# EAGLE design bms (EAGLE 4.13)
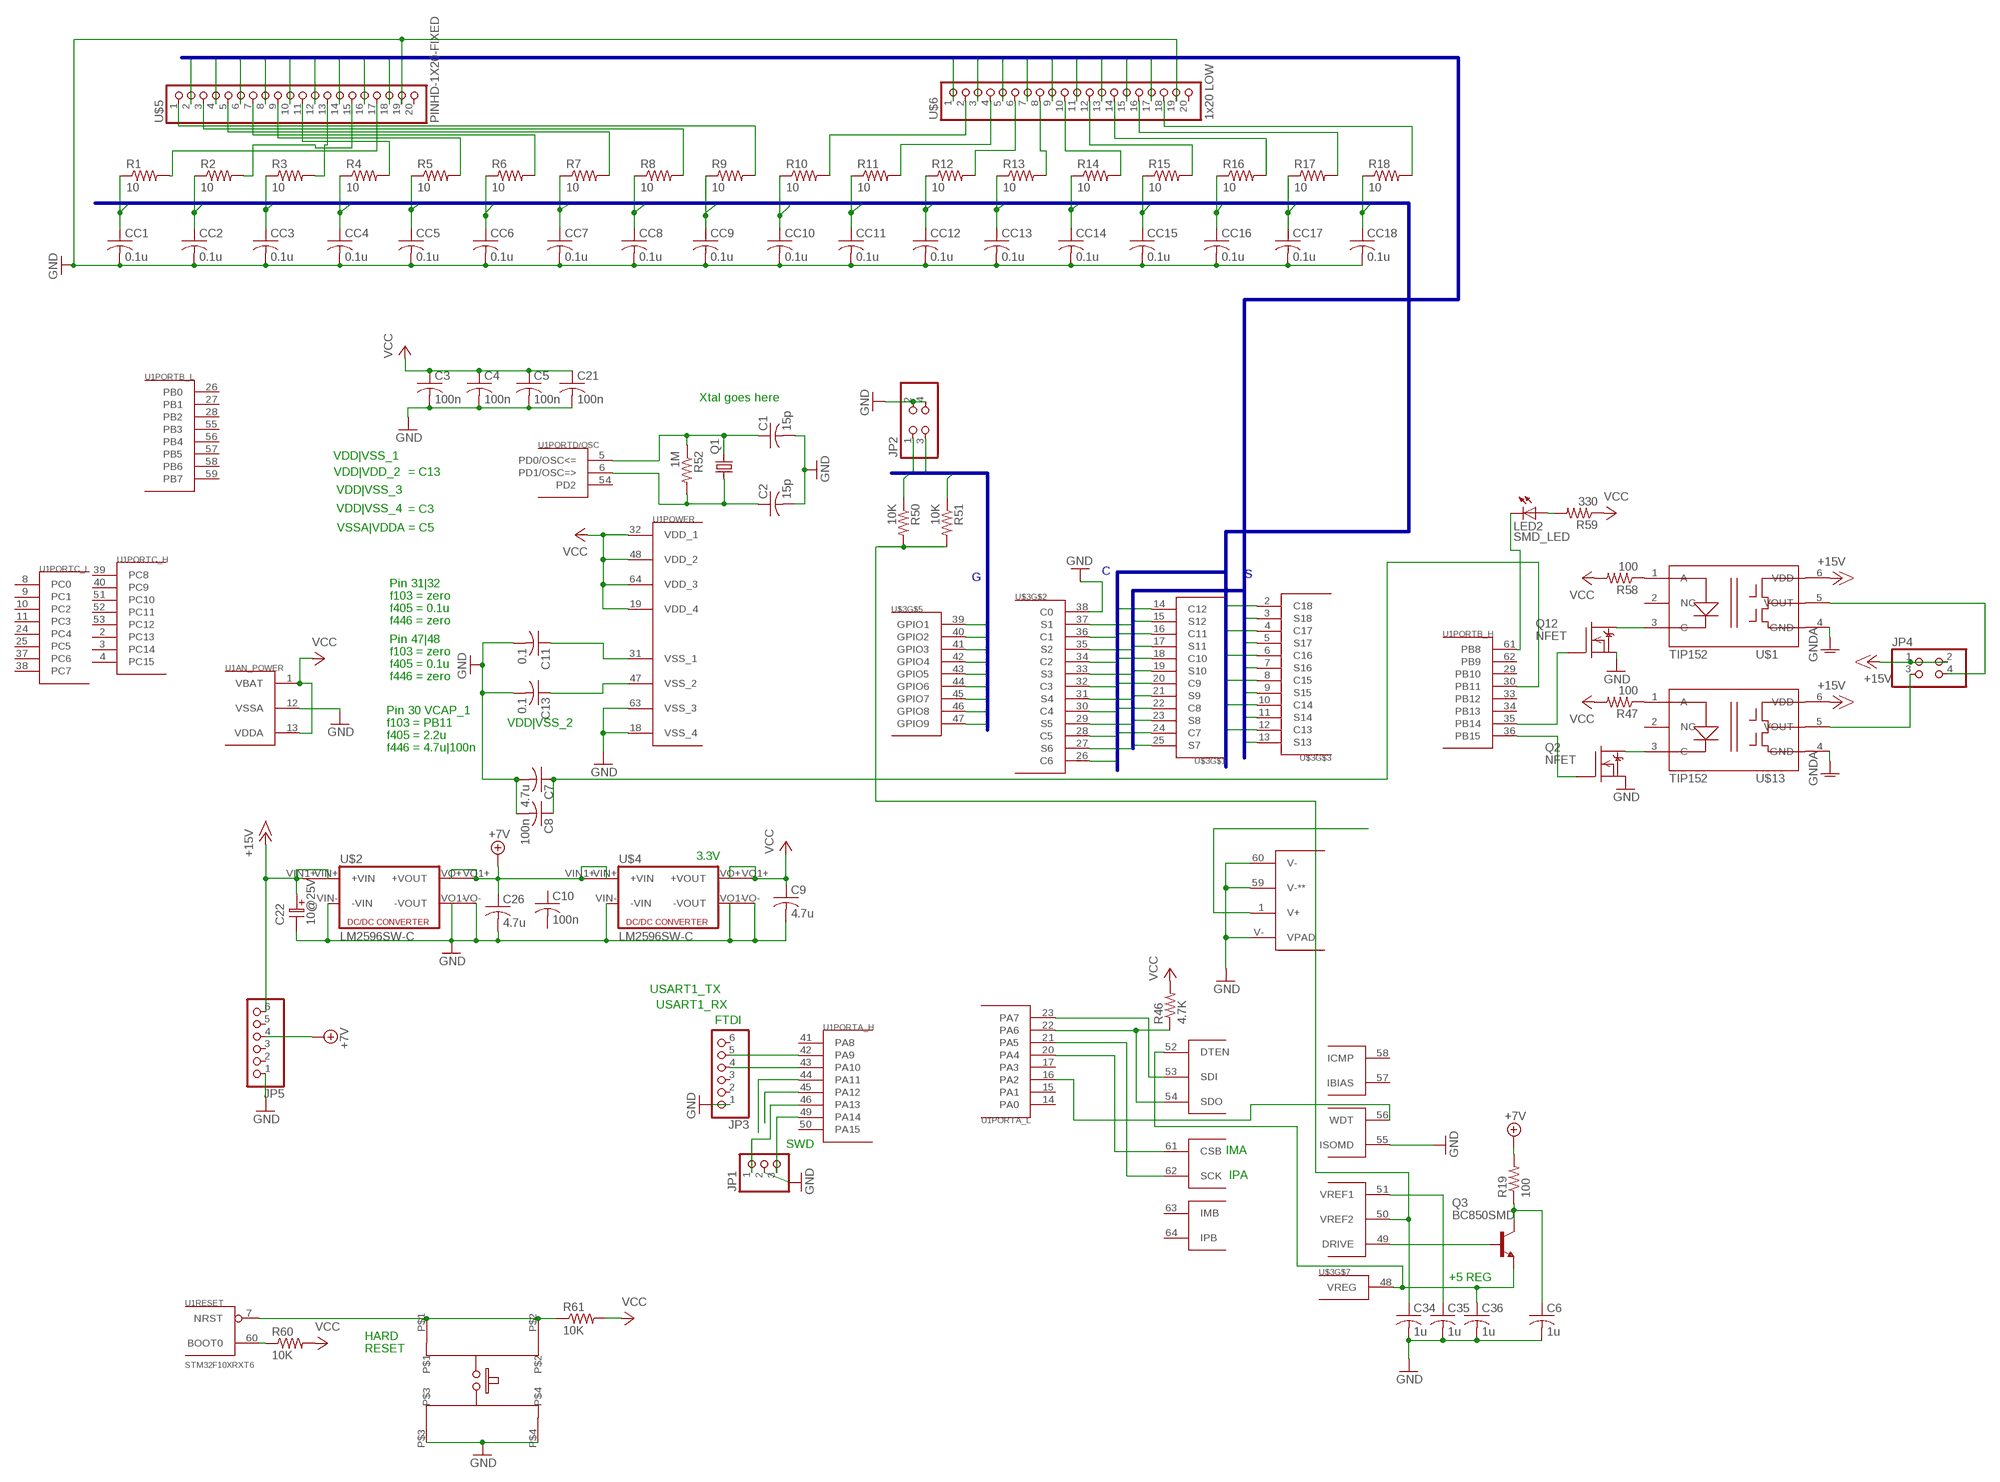
[diagram p0: schematic, sheet 1]

## Parts
C1  15p  C-USC0603  [C0603]
C2  15p  C-USC0603  [C0603]
C3  100n  C-USC0603  [C0603]
C4  100n  C-USC0603  [C0603]
C5  100n  C-USC0603  [C0603]
C6  1u  C-USC0603  [C0603]
C7  4.7u  C-USC0603  [C0603]
C8  100n  C-USC0603  [C0603]
C9  4.7u  C-USC0805  [C0805]
C10  100n  C-USC0603  [C0603]
C11  0.1  C-USC0603  [C0603]
C13  0.1  C-USC0603  [C0603]
C21  100n  C-USC0603  [C0603]
C22  10@25V  ELC-2,5L  [ES-2,5L]
C26  4.7u  C-USC0603  [C0603]
C34  1u  C-USC0603  [C0603]
C35  1u  C-USC0603  [C0603]
C36  1u  C-USC0603  [C0603]
CC1  0.1u  C-USC0805  [C0805]
CC2  0.1u  C-USC0805  [C0805]
CC3  0.1u  C-USC0805  [C0805]
CC4  0.1u  C-USC0805  [C0805]
CC5  0.1u  C-USC0805  [C0805]
CC6  0.1u  C-USC0805  [C0805]
CC7  0.1u  C-USC0805  [C0805]
CC8  0.1u  C-USC0805  [C0805]
CC9  0.1u  C-USC0805  [C0805]
CC10  0.1u  C-USC0805  [C0805]
CC11  0.1u  C-USC0805  [C0805]
CC12  0.1u  C-USC0805  [C0805]
CC13  0.1u  C-USC0805  [C0805]
CC14  0.1u  C-USC0805  [C0805]
CC15  0.1u  C-USC0805  [C0805]
CC16  0.1u  C-USC0805  [C0805]
CC17  0.1u  C-USC0805  [C0805]
CC18  0.1u  C-USC0805  [C0805]
JP1  PINHD-1X3  [1X03]
JP2  PINHD-2X2  [2X02]
JP3  PINHD-1X6  [1X06]
JP4  PINHD-2X2  [2X02]
JP5  PINHD-1X6  [1X06]
LED2  SMD_LED  [SMD_LED]
Q1  CRYTALHC49S  [HC49/S]
Q2  NFET  DMN3404L  [SOT-23]
Q3  BC850SMD  [SOT23-BEC]
Q12  NFET  DMN3404L  [SOT-23]
R1  10  R-US_R0603  [R0603]
R2  10  R-US_R0603  [R0603]
R3  10  R-US_R0603  [R0603]
R4  10  R-US_R0603  [R0603]
R5  10  R-US_R0603  [R0603]
R6  10  R-US_R0603  [R0603]
R7  10  R-US_R0603  [R0603]
R8  10  R-US_R0603  [R0603]
R9  10  R-US_R0603  [R0603]
R10  10  R-US_R0603  [R0603]
R11  10  R-US_R0603  [R0603]
R12  10  R-US_R0603  [R0603]
R13  10  R-US_R0603  [R0603]
R14  10  R-US_R0603  [R0603]
R15  10  R-US_R0603  [R0603]
R16  10  R-US_R0603  [R0603]
R17  10  R-US_R0603  [R0603]
R18  10  R-US_R0603  [R0603]
R19  100  R-US_R0603  [R0603]
R46  4.7K  R-US_R0603  [R0603]
R47  100  R-US_R0603  [R0603]
R50  10K  R-US_R0603  [R0603]
R51  10K  R-US_R0603  [R0603]
R52  1M  R-US_R0603  [R0603]
R58  100  R-US_R0603  [R0603]
R59  330  R-US_R0603  [R0603]
R60  10K  R-US_R0603  [R0603]
R61  10K  R-US_R0603  [R0603]
SW1  E-SWITCH  [E-SWITCH]
U1  STM32F10XRXT6  [TQFP64]
U$1  TIP152  SI826  [SDIP6]
U$2  LM2596SW-C  [LM2596SW-C]
U$3  LTC6813  [TQFP64_PAD]
U$4  LM2596SW-C  [LM2596SW-C]
U$5  PINHD-1X20-FIXED  [1X20]
U$6  1x20 LOW  PINHD-1X20-FIXED  [1X20]
U$13  TIP152  SI826  [SDIP6]

## Nets
+7V: C26.1 JP5.4 R19.2 U$2.VO1+(+VOUT1) U$2.VO+(+VOUT) U$4.VIN+(+VIN)
+15V: C22.1 JP4.1 JP4.2 JP5.6 U$1.6(VDD) U$2.VIN1+(+VIN1) U$2.VIN+(+VIN) U$13.6(VDD)
BOOT0: R60.1 U1.60(RESET:BOOT0)
C1: CC1.1 R1.1 U$3.36(C1)
C2: CC2.1 R2.1 U$3.34(C2)
C3: CC3.1 R3.1 U$3.32(C3)
C4: CC4.1 R4.1 U$3.30(C4)
C5: CC5.1 R5.1 U$3.28(C5)
C6: CC6.1 R6.1 U$3.26(C6)
C7: CC7.1 R7.1 U$3.24(C7)
C8: CC8.1 R8.1 U$3.22(C8)
C9: CC9.1 R9.1 U$3.20(C9)
C10: CC10.1 R10.1 U$3.18(C10)
C11: CC11.1 R11.1 U$3.16(C11)
C12: CC12.1 R12.1 U$3.14(C12)
C13: CC13.1 R13.1 U$3.12(C13)
C14: CC14.1 R14.1 U$3.10(C14)
C15: CC15.1 R15.1 U$3.8(C15)
C16: CC16.1 R16.1 U$3.6(C16)
C17: CC17.1 R17.1 U$3.4(C17)
C18: CC18.1 R18.1 U$3.2(C18)
CF10: R10.2 U$6.2
CF11: R11.2 U$6.4
CF12: R12.2 U$6.6
CF13: R13.2 U$6.8
CF14: R14.2 U$6.10
CF15: R15.2 U$6.12
CF16: R16.2 U$6.14
CF17: R17.2 U$6.16
CF18: R18.2 U$6.18
CL1: R1.2 U$5.17
CL2: R2.2 U$5.15
CL3: R3.2 U$5.13
CL4: R4.2 U$5.11
CL5: R5.2 U$5.9
CL6: R6.2 U$5.7
CL7: R7.2 U$5.5
CL8: R8.2 U$5.3
CL9: R9.2 U$5.1
G1: JP2.1 R50.1 U$3.39(GPIO1)
G2: JP2.3 R51.1 U$3.40(GPIO2)
G3: U$3.41(GPIO3)
G4: U$3.42(GPIO4)
G5: U$3.43(GPIO5)
G6: U$3.44(GPIO6)
G7: U$3.45(GPIO7)
G8: U$3.46(GPIO8)
G9: U$3.47(GPIO9)
GND: C1.2 C2.2 C3.2 C4.2 C5.2 C6.2 C7.2 C8.2 C9.2 C11.2 C13.2 C21.2 C22.2 C26.2 C34.2 C35.2 C36.2 CC1.2 CC2.2 CC3.2 CC4.2 CC5.2 CC6.2 CC7.2 CC8.2 CC9.2 CC10.2 CC11.2 CC12.2 CC13.2 CC14.2 CC15.2 CC16.2 CC17.2 CC18.2 JP1.2 JP2.2 JP2.4 JP3.1 JP5.1 Q2.2(S) Q12.2(S) SW1.P$3 SW1.P$4 U1.12(AN_POWER:VSSA) U1.18(POWER:VSS_4) U1.63(POWER:VSS_3) U$2.VIN-(-VIN) U$2.VO1-(-VOUT) U$2.VO-(-VOUT1) U$3.38(C0) U$3.55(ISOMD) U$3.59(V-**) U$3.60(V-) U$3.V-(VPAD) U$4.VIN-(-VIN) U$4.VO1-(-VOUT) U$4.VO-(-VOUT1) U$5.19 U$6.19
GNDA: U$1.4(GND) U$13.4(GND)
JTCK: JP1.3 U1.49(PORTA_H:PA14)
JTMS: JP1.1 U1.46(PORTA_H:PA13)
LED|R: LED2.A R59.2
N$1: Q3.B U$3.49(DRIVE)
N$2: C6.1 Q3.C R19.1
N$3: JP4.3 U$13.5(VOUT)
N$8: JP4.4 U$1.5(VOUT)
N$10: R58.1 U$1.1(A)
N$11: R47.1 U$13.1(A)
N$12: Q12.3(D) U$1.3(C)
N$13: Q2.3(D) U$13.3(C)
N$14: Q2.1(G) U1.36(PORTB_H:PB15)
N$15: Q12.1(G) U1.35(PORTB_H:PB14)
NRST: R61.1 SW1.P$1 SW1.P$2 U1.7(RESET:NRST)
PA2|WDT: U1.16(PORTA_L:PA2) U$3.56(WDT)
PA9_USART1_TX: JP3.5 U1.42(PORTA_H:PA9)
PA10_USART1_RX: JP3.4 U1.43(PORTA_H:PA10)
PA11_CANRXD: U1.44(PORTA_H:PA11)
PA12-CANTXD: U1.45(PORTA_H:PA12)
PB8|LED: LED2.C U1.61(PORTB_H:PB8)
PB11|VCAP: C7.1 C8.1 U1.30(PORTB_H:PB11)
PD0_OSC_IN_XTAL: C1.1 Q1.2 R52.1 U1.5(PORTD/OSC:PD0/OSC<=)
PD1_OSC_OUT: C2.1 Q1.1 R52.2 U1.6(PORTD/OSC:PD1/OSC=>)
S1: U$3.37(S1) U$5.18
S2: U$3.35(S2) U$5.16
S3: U$3.33(S3) U$5.14
S4: U$3.31(S4) U$5.12
S5: U$3.29(S5) U$5.10
S6: U$3.27(S6) U$5.8
S7: U$3.25(S7) U$5.6
S8: U$3.23(S8) U$5.4
S9: U$3.21(S9) U$5.2
S10: U$3.19(S10) U$6.1
S11: U$3.17(S11) U$6.3
S12: U$3.15(S12) U$6.5
S13: U$3.13(S13) U$6.7
S14: U$3.11(S14) U$6.9
S15: U$3.9(S15) U$6.11
S16: U$3.7(S16) U$6.13
S17: U$3.5(S17) U$6.15
S18: U$3.3(S18) U$6.17
SP1_MISO-SDO: R46.1 U1.22(PORTA_L:PA6) U$3.54(SDO)
SP1_NSS-CSB: U1.20(PORTA_L:PA4) U$3.61(CSB)
SPI1_MOSI-SDI: U1.23(PORTA_L:PA7) U$3.53(SDI)
SPI1_SCK-CLK: U1.21(PORTA_L:PA5) U$3.62(SCK)
VCC: C3.1 C4.1 C5.1 C9.1 C21.1 R46.2 R47.2 R58.2 R59.1 R60.2 R61.2 U1.1(AN_POWER:VBAT) U1.13(AN_POWER:VDDA) U1.19(POWER:VDD_4) U1.32(POWER:VDD_1) U1.48(POWER:VDD_2) U1.64(POWER:VDD_3) U$4.VO1+(+VOUT1) U$4.VO+(+VOUT)
VREF1: C35.1 U$3.51(VREF1)
VREF2: C34.1 R50.2 R51.2 U$3.50(VREF2)
VREG: C36.1 Q3.E U$3.48(VREG) U$3.52(DTEN)
VSS_1: C11.1 U1.31(POWER:VSS_1)
VSS_2: C13.1 U1.47(POWER:VSS_2)
X18: U$3.1(V+)
Unconnected: C10.1 C10.2 JP3.2 JP3.3 JP3.6 JP5.2 JP5.3 JP5.5 U1.2(PORTC_H:PC13) U1.3(PORTC_H:PC14) U1.4(PORTC_H:PC15) U1.8(PORTC_L:PC0) U1.9(PORTC_L:PC1) U1.10(PORTC_L:PC2) U1.11(PORTC_L:PC3) U1.14(PORTA_L:PA0) U1.15(PORTA_L:PA1) U1.17(PORTA_L:PA3) U1.24(PORTC_L:PC4) U1.25(PORTC_L:PC5) U1.26(PORTB_L:PB0) U1.27(PORTB_L:PB1) U1.28(PORTB_L:PB2) U1.29(PORTB_H:PB10) U1.33(PORTB_H:PB12) U1.34(PORTB_H:PB13) U1.37(PORTC_L:PC6) U1.38(PORTC_L:PC7) U1.39(PORTC_H:PC8) U1.40(PORTC_H:PC9) U1.41(PORTA_H:PA8) U1.50(PORTA_H:PA15) U1.51(PORTC_H:PC10) U1.52(PORTC_H:PC11) U1.53(PORTC_H:PC12) U1.54(PORTD/OSC:PD2) U1.55(PORTB_L:PB3) U1.56(PORTB_L:PB4) U1.57(PORTB_L:PB5) U1.58(PORTB_L:PB6) U1.59(PORTB_L:PB7) U1.62(PORTB_H:PB9) U$1.2(NC) U$3.57(IBIAS) U$3.58(ICMP) U$3.63(IMB) U$3.64(IPB) U$4.VIN1+(+VIN1) U$5.20 U$6.20 U$13.2(NC)

## Buses
G[1..9]
C[0..18]
S[1..18]

## Notes on the sheet
- Xtal goes here
- VDD|VSS_1
- VDD|VDD_2 | = C13
- VDD|VSS_3
- VDD|VSS_4
- = C3
- VSSA|VDDA = C5
- C | S
- G
- Pin 31|32
- f103 = zero
- f405 = 0.1u
- f446 = zero
- Pin 47|48
- f103 = zero
- f405 = 0.1u
- f446 = zero
- Pin 30 VCAP_1
- f103 = PB11 | VDD|VSS_2
- f405 = 2.2u
- f446 = 4.7u|100n
- 3.3V
- USART1_TX
- USART1_RX
- FTDI
- SWD
- IMA
- IPA
- +5 REG
- HARD
- RESET

## Library data of the parts
C1-C11 C13 C21 C26 C34-C36 CC1-CC18 = rcl:C-US: CAPACITOR, American symbol
C22 = DEH:ELC-2,5L
JP1 = pinhead:PINHD-1X3: PIN HEADER
JP2 JP4 = pinhead:PINHD-2X2: PIN HEADER
JP3 JP5 = pinhead:PINHD-1X6: PIN HEADER
LED2 = led:SMD_LED
Q1 = crystal:CRYTAL: CRYSTAL
Q2 Q12 = transistor-fet:DMN3404L
Q3 = transistor-npn:BC850*: NPN Transistor
R1-R19 R46 R47 R50-R52 R58-R61 = rcl:R-US_: RESISTOR, American symbol
SW1 = switch-misc:E-SWITCH
U1 = stm32:STM32F10XRXT6: STM32F101/103 64pin LQFP
U$1 U$13 = DEH:SI826
U$2 U$4 = dc-dc-converter:LM2596SW-C
U$3 = stm32:LTC6813
U$5 U$6 = pinhead:PINHD-1X20-FIXED

## Board
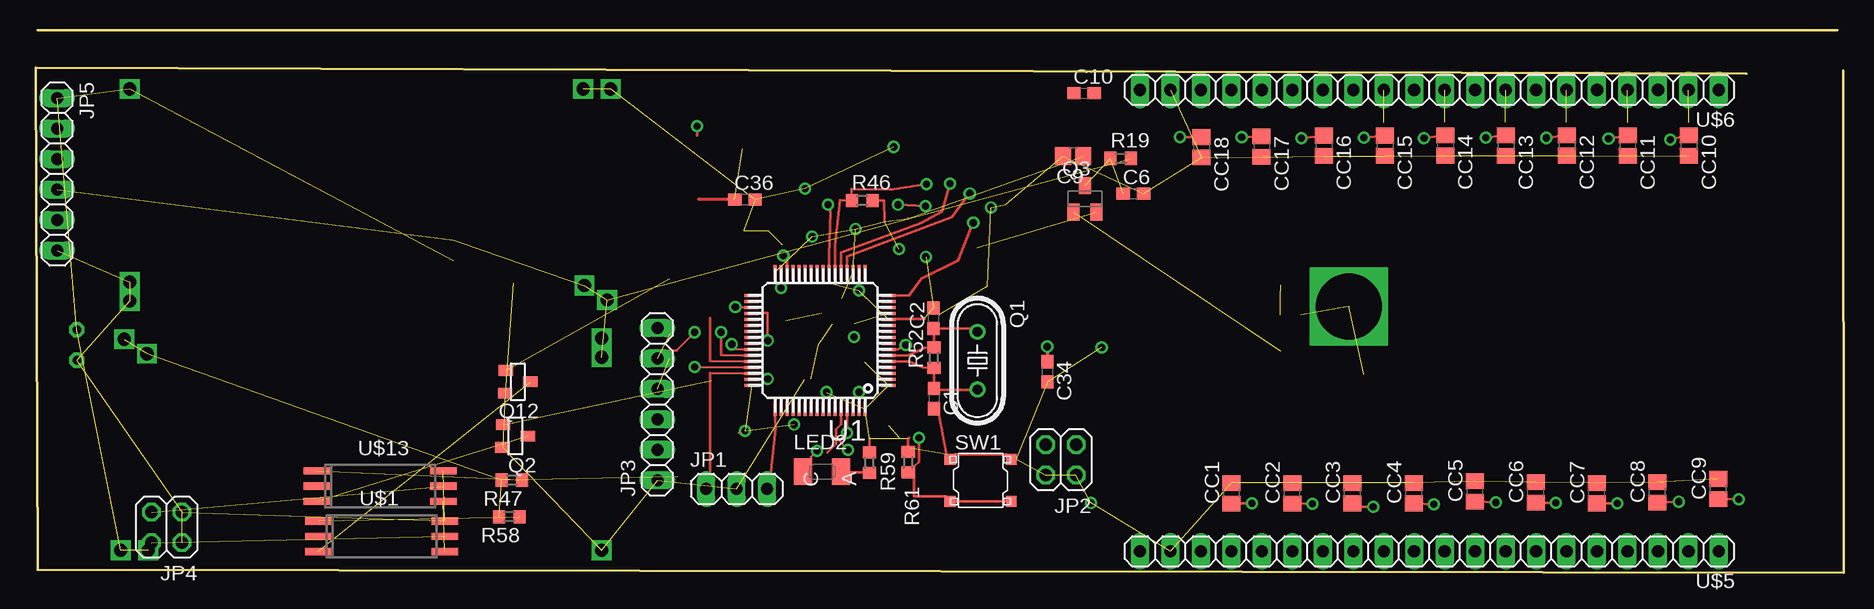
[diagram p1: board, top side]
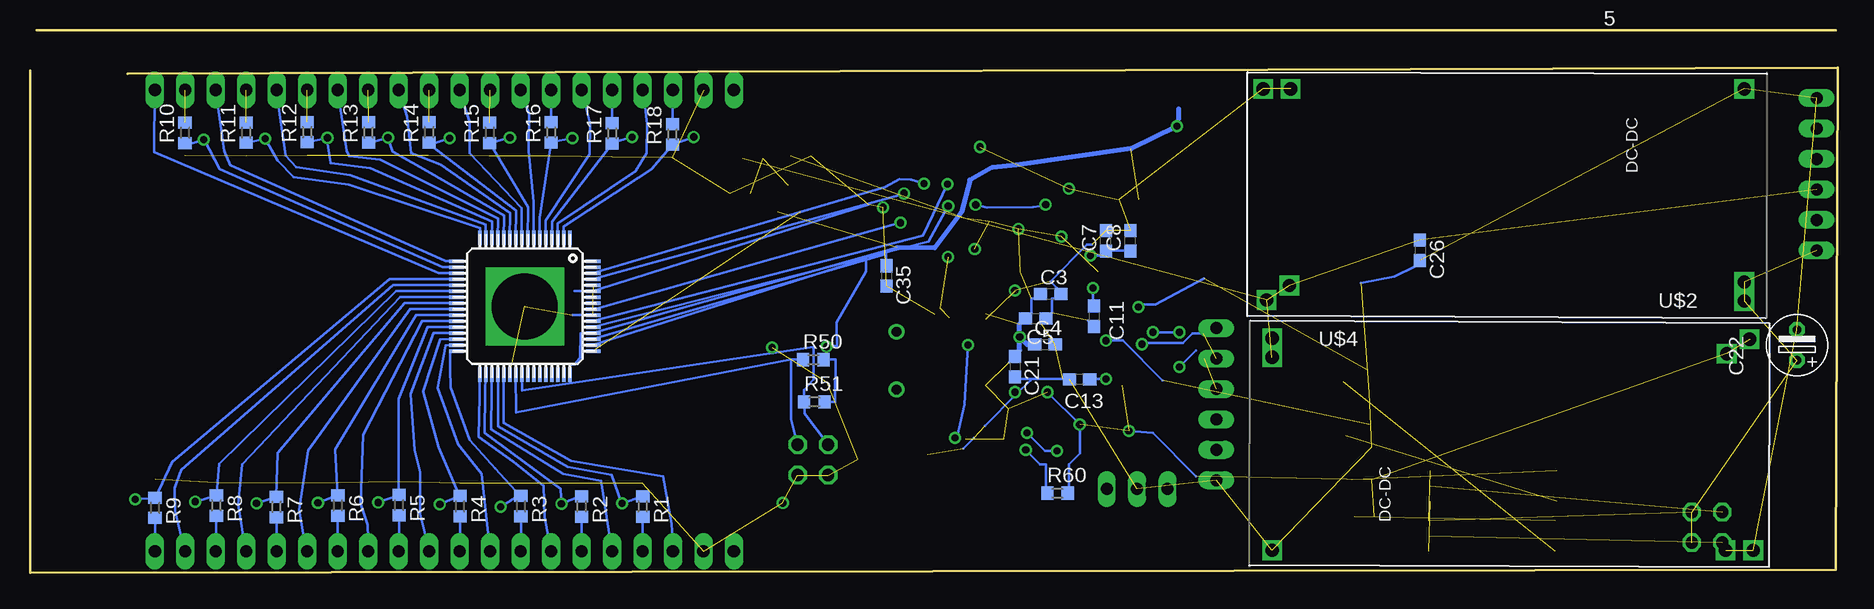
[diagram p2: board, bottom side, seen from below]

Size 150.7 x 45.25 mm. Coordinates in mm from the lower left corner, seen from the top.
Outline: 0,42.11 0.16,0.24 150.7,0 150.67,41.84
Outline: 0,42.11 0,41.94
Outline: 0,42.11 142.56,41.61
Outline: 0.16,45.25 150.14,45.24
Copper layers (1*16): Top 0.035mm / dielectric 1.5mm / Bottom 0.035mm
Design rules "default": minimum track width 8mil, minimum drill 0.6mm, track to track 0.2083mm, track to pad 8mil, pad to pad 8mil, via to via 8mil, smd to smd 0mil, copper to edge 8mil, drill to drill 8mil, minimum pad ring 10mil, minimum via ring 8mil, stop-mask expansion 4mil, vias tented up to drill 0mil, thermal gap 10mil

### Footprints (pad centres in the part's own frame; a part is rotated, then mirrored left to right if it is on the bottom)
C0603 = smd 1.1 x 1: 1 -0.85,0; 2 0.85,0
C0805 = smd 1.3 x 1.5: 1 -0.85,0; 2 0.85,0
ES-2,5L = drill 0.711 pad 1.27 octagon: 1 0,0; 2 2.54,0
1X03 = drill 1 long: 1 -2.54,0; 2 0,0; 3 2.54,0
2X02 = drill 1.016 octagon: 1 -1.27,-1.27; 2 -1.27,1.27; 3 1.27,-1.27; 4 1.27,1.27
1X06 = drill 1 long: 1 -6.35,0; 2 -3.81,0; 3 -1.27,0; 4 1.27,0; 5 3.81,0; 6 6.35,0
SMD_LED = smd 2.2 x 1.5: A 0,1.6; C 0,-1.6
HC49/S = drill 0.813 round: 1 -2.413,0; 2 2.413,0
SOT-23 = smd 0.9 x 1.2: 1 -1,-1.006; 2 0.9,-1.056; 3 -0.05,1.056
SOT23-BEC = smd 1 x 1.4: B -0.95,-1.1; C 0,1.1; E 0.95,-1.1
R0603 = smd 1 x 1.1: 1 -0.85,0; 2 0.85,0
E-SWITCH = smd 0.9 x 0.9: P$1 -2.55,1.75; P$2 2.55,1.75; P$3 -2.55,-1.75; P$4 2.55,-1.75
TQFP64 = smd 1.2 x 0.26: 1 -5.7,3.75; 2 -5.7,3.25; 3 -5.7,2.75; 4 -5.7,2.25; 5 -5.7,1.75; 6 -5.7,1.25; 7 -5.7,0.75; 8 -5.7,0.25; 9 -5.7,-0.25; 10 -5.7,-0.75; 11 -5.7,-1.25; 12 -5.7,-1.75; 13 -5.7,-2.25; 14 -5.7,-2.75; 15 -5.7,-3.25; 16 -5.7,-3.75; 33 5.7,-3.75; 34 5.7,-3.25; 35 5.7,-2.75; 36 5.7,-2.25; 37 5.7,-1.75; 38 5.7,-1.25; 39 5.7,-0.75; 40 5.7,-0.25; 41 5.7,0.25; 42 5.7,0.75; 43 5.7,1.25; 44 5.7,1.75; 45 5.7,2.25; 46 5.7,2.75; 47 5.7,3.25; 48 5.7,3.75 | smd 0.26 x 1.2: 17 -3.75,-5.7; 18 -3.25,-5.7; 19 -2.75,-5.7; 20 -2.25,-5.7; 21 -1.75,-5.7; 22 -1.25,-5.7; 23 -0.75,-5.7; 24 -0.25,-5.7; 25 0.25,-5.7; 26 0.75,-5.7; 27 1.25,-5.7; 28 1.75,-5.7; 29 2.25,-5.7; 30 2.75,-5.7; 31 3.25,-5.7; 32 3.75,-5.7; 49 3.75,5.7; 50 3.25,5.7; 51 2.75,5.7; 52 2.25,5.7; 53 1.75,5.7; 54 1.25,5.7; 55 0.75,5.7; 56 0.25,5.7; 57 -0.25,5.7; 58 -0.75,5.7; 59 -1.25,5.7; 60 -1.75,5.7; 61 -2.25,5.7; 62 -2.75,5.7; 63 -3.25,5.7; 64 -3.75,5.7
SDIP6 = smd 0.6 x 2.2: 1 -1.895,-5.33; 2 -0.625,-5.33; 3 0.645,-5.33; 4 0.645,5.22; 5 -0.625,5.22; 6 -1.895,5.22
LM2596SW-C = drill 1.1 square: VIN1+ -19,9.5; VIN+ -19,7.9; VIN- -19,-8.2; VO1+ 20.8,9.4; VO1- 21.1,-8.2; VO+ 18.9,8.2; VO- 18.8,-8.2
TQFP64_PAD = smd 1.2 x 0.26: 1 -5.7,3.75; 2 -5.7,3.25; 3 -5.7,2.75; 4 -5.7,2.25; 5 -5.7,1.75; 6 -5.7,1.25; 7 -5.7,0.75; 8 -5.7,0.25; 9 -5.7,-0.25; 10 -5.7,-0.75; 11 -5.7,-1.25; 12 -5.7,-1.75; 13 -5.7,-2.25; 14 -5.7,-2.75; 15 -5.7,-3.25; 16 -5.7,-3.75; 33 5.7,-3.75; 34 5.7,-3.25; 35 5.7,-2.75; 36 5.7,-2.25; 37 5.7,-1.75; 38 5.7,-1.25; 39 5.7,-0.75; 40 5.7,-0.25; 41 5.7,0.25; 42 5.7,0.75; 43 5.7,1.25; 44 5.7,1.75; 45 5.7,2.25; 46 5.7,2.75; 47 5.7,3.25; 48 5.7,3.75 | smd 0.26 x 1.2: 17 -3.75,-5.7; 18 -3.25,-5.7; 19 -2.75,-5.7; 20 -2.25,-5.7; 21 -1.75,-5.7; 22 -1.25,-5.7; 23 -0.75,-5.7; 24 -0.25,-5.7; 25 0.25,-5.7; 26 0.75,-5.7; 27 1.25,-5.7; 28 1.75,-5.7; 29 2.25,-5.7; 30 2.75,-5.7; 31 3.25,-5.7; 32 3.75,-5.7; 49 3.75,5.7; 50 3.25,5.7; 51 2.75,5.7; 52 2.25,5.7; 53 1.75,5.7; 54 1.25,5.7; 55 0.75,5.7; 56 0.25,5.7; 57 -0.25,5.7; 58 -0.75,5.7; 59 -1.25,5.7; 60 -1.75,5.7; 61 -2.25,5.7; 62 -2.75,5.7; 63 -3.25,5.7; 64 -3.75,5.7 | smd 5.8 x 5.8: V- 0,0
1X20 = drill 1.016 long: 1 -24.13,0; 2 -21.59,0; 3 -19.05,0; 4 -16.51,0; 5 -13.97,0; 6 -11.43,0; 7 -8.89,0; 8 -6.35,0; 9 -3.81,0; 10 -1.27,0; 11 1.27,0; 12 3.81,0; 13 6.35,0; 14 8.89,0; 15 11.43,0; 16 13.97,0; 17 16.51,0; 18 19.05,0; 19 21.59,0; 20 24.13,0

### Placement (x,y rotation side)
C1  74.86,14.51 270 top
C2  74.84,21.2 90 top
C3  65.61,23.25 0 bottom
C4  66.09,19.01 0 bottom
C5  66.86,21.18 0 bottom
C6  91.49,31.6 0 top
C7  61.03,27.66 90 bottom
C8  58.99,27.67 90 bottom
C9  86.46,34.72 180 top
C10  87.37,39.98 0 top
C11  62.01,21.37 270 bottom
C13  63.21,16.1 180 bottom
C21  68.61,17.16 270 bottom
C22  3.41,17.7 90 bottom
C26  34.83,26.88 270 bottom
C34  84.3,16.74 270 top
C35  79.31,24.74 270 bottom
C36  59.1,31.12 0 top
CC1  99.67,6.61 90 top
CC2  104.72,6.61 90 top
CC3  109.75,6.62 90 top
CC4  114.86,6.62 90 top
CC5  119.96,6.77 90 top
CC6  125.02,6.68 90 top
CC7  130.12,6.62 90 top
CC8  135.15,6.69 90 top
CC9  140.25,6.96 90 top
CC10  137.79,35.61 270 top
CC11  132.68,35.6 270 top
CC12  127.61,35.62 270 top
CC13  122.53,35.61 270 top
CC14  117.48,35.62 270 top
CC15  112.44,35.59 270 top
CC16  107.35,35.59 270 top
CC17  102.17,35.51 270 top
CC18  97.16,35.46 270 top
JP1  58.41,6.97 0 top
JP2  85.44,9.39 180 top
JP3  51.81,14.04 90 top
JP4  10.91,3.77 180 top
JP5  1.77,33.22 270 top
LED2  65.53,8.42 270 top
Q1  78.48,17.67 270 top
Q2  39.95,11.33 270 top
Q3  87.45,31.17 0 top
Q12  40.17,15.86 270 top
R1  99.62,5.51 270 bottom
R2  104.72,5.51 270 bottom
R3  109.78,5.53 270 bottom
R4  114.85,5.53 270 bottom
R5  119.94,5.63 270 bottom
R6  125.04,5.6 270 bottom
R7  130.15,5.47 270 bottom
R8  135.16,5.6 270 bottom
R9  140.28,5.4 270 bottom
R10  137.78,36.68 90 bottom
R11  132.68,36.69 90 bottom
R12  127.59,36.73 90 bottom
R13  122.48,36.7 90 bottom
R14  117.43,36.72 90 bottom
R15  112.38,36.68 90 bottom
R16  107.25,36.71 90 bottom
R17  102.17,36.62 90 bottom
R18  97.15,36.54 90 bottom
R19  90.44,34.54 0 top
R46  68.87,31.03 0 top
R47  39.68,7.71 180 top
R50  85.4,17.75 0 bottom
R51  85.31,14.24 0 bottom
R52  74.86,17.9 90 top
R58  39.47,4.65 180 top
R59  69.48,9.16 270 top
R60  65.05,6.62 0 bottom
R61  72.71,9.19 90 top
SW1  78.75,7.7 180 top
U1  65.37,19.36 180 top
U$1  28.87,2.4 270 top
U$2  26.81,32.14 180 bottom
U$3  109.45,22.21 270 bottom
U$4  28.16,10.05 0 bottom
U$5  116.16,1.77 180 top
U$6  116.16,40.25 180 top
U$13  28.74,6.58 270 top

### Tracks (layer width: path | path; a pad name or v marks a point on that pad's centre or on a via)
+7V  (5 unrouted)
+15V  (7 unrouted)
BOOT0  (via drill 0.6)
  Top 0.203: 66,10.04 66.7,10.74 66.7,11.14 | 66.7,11.14 66.7,11.94 67.1,12.34 67.1,13.14 U1.60 | v67.7,10.24 66.8,11.14 66.7,11.14
  Bottom 0.203: v67.7,10.24 66.5,9.04 66,9.04 66,7.14 R60.1
C1  (via drill 0.6)
  Top 0.203: v101.35,5.76 CC1.1
  Bottom 0.203: U$3.36 111.69,15.25 111.67,12.18 105.87,8.8 102.21,8.14 101.39,5.78 v101.35,5.76 R1.1
C2  (via drill 0.6)
  Top 0.203: v106.4,5.74 CC2.1
  Bottom 0.203: U$3.34 112.75,14.93 112.81,11.64 106.47,6.97 106.4,5.6 v106.4,5.74 104.74,6.45 R2.1
C3  (via drill 0.6)
  Top 0.203: CC3.1 109.72,5.46 v111.47,5.47
  Bottom 0.203: U$3.32 115.66,18.48 115.68,18 115.69,16.96 115.63,15.44 114.06,11.05 111.93,8.7 109.79,6.36 R3.1 109.79,6.52 v111.47,5.47
C4  (via drill 0.6)
  Top 0.203: v116.54,5.69 CC4.1
  Bottom 0.203: U$3.30 116.51,19.44 117.92,15.11 116.62,10.43 114.88,6.36 R4.1 114.9,6.38 v116.54,5.69
C5  (via drill 0.6)
  Top 0.203: v121.69,5.84 CC5.1
  Bottom 0.203: U$3.28 117.55,20.46 119.97,14.49 119.95,6.55 R5.1 120,6.45 v121.69,5.84
C6  (via drill 0.6)
  Top 0.203: v126.7,5.82 CC6.1
  Bottom 0.203: U$3.26 118.52,21.46 125.28,10.28 125.04,6.39 R6.1 125.08,6.44 v126.7,5.82
C7  (via drill 0.6)
  Top 0.203: v131.82,5.78 CC7.1
  Bottom 0.203: U$3.24 119.45,22.46 130.06,9.97 130.16,6.34 R7.1 v131.82,5.78
C8  (via drill 0.6)
  Top 0.203: v136.94,5.91 CC8.1
  Bottom 0.203: U$3.22 120.17,23.46 134.95,9.08 135.15,6.55 R8.1 135.15,6.42 v136.94,5.91
C9  (via drill 0.6)
  Top 0.203: CC9.1 140.32,6.14 v141.94,6.1
  Bottom 0.203: U$3.20 120.72,24.46 138.86,9.21 140.27,6.18 R9.1 v141.94,6.1
C10  (via drill 0.6)
  Top 0.203: v136.23,36.11 CC10.1
  Bottom 0.203: R10.1 137.78,35.61 v136.23,36.11 136.18,36.09 134.9,33.65 116.31,25.46 U$3.18
C11  (via drill 0.6)
  Top 0.203: v131.09,36.19 CC11.1
  Bottom 0.203: R11.1 132.7,35.82 v131.09,36.19 131.11,36.19 130.05,34.35 128.72,32.97 124.13,32.37 113.19,28.74 U$3.16
C12  (via drill 0.6)
  Top 0.203: v125.91,36.25 CC12.1
  Bottom 0.203: R12.1 v125.91,36.25 125.98,36.29 125.62,34.16 122.36,33.71 112.17,29.25 U$3.14
C13  (via drill 0.6)
  Top 0.203: v120.86,36.27 CC13.1
  Bottom 0.203: R13.1 122.49,35.83 v120.86,36.27 120.9,36.28 120.48,35.12 117.9,33.64 111.19,29.75 U$3.12
C14  (via drill 0.6)
  Top 0.203: v115.71,36.22 CC14.1
  Bottom 0.203: v115.71,36.22 117.48,35.63 R14.1 117.42,35.72 110.19,30.2 U$3.10
C15  (via drill 0.6)
  Top 0.203: v110.7,36.27 CC15.1
  Bottom 0.203: v110.7,36.27 R15.1 112.4,35.84 109.19,30.48 U$3.8
C16  (via drill 0.6)
  Top 0.203: v105.49,36.24 CC16.1
  Bottom 0.203: v105.49,36.24 107.25,35.9 R16.1 108.2,29.55 U$3.6
C17  (via drill 0.6)
  Top 0.203: v100.51,36.32 CC17.1
  Bottom 0.203: v100.51,36.32 102.19,35.84 R17.1 102.13,35.8 107.18,29.26 U$3.4
C18  (via drill 0.6)
  Top 0.203: v95.37,36.33 CC18.1
  Bottom 0.203: U$3.2 106.2,28.84 98.9,33.63 97.12,35.69 R18.1 v95.37,36.33
CF10  (1 unrouted)
CF11  (1 unrouted)
CF12  (1 unrouted)
CF13  (1 unrouted)
CF14  (1 unrouted)
CF15  (1 unrouted)
CF16
  Bottom 0.203: U$6.14 107.29,40.25 R16.2
CF17
  Bottom 0.203: 102.19,40.29 U$6.16 102.21,40.31 R17.2
CF18
  Bottom 0.203: 97.18,40.25 U$6.18 97.11,40.31 R18.2
CL1
  Bottom 0.203: U$5.17 99.64,1.71 R1.2
CL2
  Bottom 0.203: U$5.15 R2.2
CL3
  Bottom 0.203: U$5.13 109.82,1.79 R3.2
CL4
  Bottom 0.203: U$5.11 R4.2
CL5
  Bottom 0.203: U$5.9 119.98,1.74 R5.2
CL6
  Bottom 0.203: U$5.7 125.03,1.83 R6.2
CL7
  Bottom 0.203: U$5.5 130.11,1.76 R7.2
CL8
  Bottom 0.203: U$5.3 135.17,1.78 R8.2
CL9
  Bottom 0.203: U$5.1 140.32,1.78 R9.2
G1
  Bottom 0.203: U$3.39 110.18,13.36 87.26,17.76 86.42,17.76 R50.1 87.27,17.75 87.26,12.8 86.7,10.6 JP2.1
G2
  Bottom 0.203: U$3.40 109.69,15.18 85.39,18.83 85.37,16.09 86.16,15.25 86.17,14.19 R51.1 86.14,13.28 84.19,10.67 JP2.3
GND  (via drill 0.6, 5.5)  (62 unrouted)
  Top 0.203: C1.2 75.26,13.14 75.9,9.84 SW1.P$4 76.6,9.84 80.9,9.84 SW1.P$3 81.7,9.44 | C2.2 75.26,21.54 | 74.06,21.24 74.06,21.14 71.6,21.14 U1.12 | v68.6,15.04 68.6,14.24 U1.63 | U1.18 v68.61,23.51
  Bottom 0.203: 67.3,16.14 68.2,16.14 C21.2 | 67.3,16.14 64.6,16.14 C13.2 | 68.45,14.89 67.3,16.04 67.3,16.14 | 68.45,14.89 71.1,12.24 | v68.6,15.04 68.45,14.89 | C11.2 62.5,21.04 | 66.4,20.74 C5.2 65.5,21.64 65.5,22.84 65.3,22.84 C3.2 65.1,23.74 65.65,24.29 62.6,27.34 62.2,27.34 | 72.9,10.34 72,11.24 | 80.81,30.67 U$3.59 105.31,23.47 | U$3.55 105.45,21.46 | v68.61,23.51 68.61,23.49 | 39.76,24.14 36.98,24.69 35.26,25.54 C26.2
  other vias: 88.84,18.78 109.45,22.19 79.6,30.45 74.18,26.33 87.95,5.8 64.11,32.01 71.5,35.5
GNDA  (1 unrouted)
JTCK
  Top 0.203: U1.49 61.63,13.05 61.64,12 61.23,8.09 JP1.3
JTMS
  Top 0.203: U1.46 58.95,16.62 56.2,16.64 56.2,7.74 JP1.1
LED|R
  Top 0.203: R59.2 69,8.34 67.8,8.34 LED2.A
N$1  (1 unrouted)
N$2  (2 unrouted)
N$3  (1 unrouted)
N$8  (1 unrouted)
N$10  (1 unrouted)
N$11  (1 unrouted)
N$12  (1 unrouted)
N$13  (1 unrouted)
N$14  (via drill 0.6)  (1 unrouted)
  Top 0.203: v61,19.34 61,21.64 60.2,21.64 U1.36
  Bottom 0.203: 56.3,16.04 59.6,19.34 v61,19.34
N$15  (via drill 0.6)  (1 unrouted)
  Top 0.203: v58.3,22.14 58.97,22.11 U1.35
  Bottom 0.203: 58,21.84 v58.3,22.14 57.8,22.34 56.9,22.34 52.84,24.51
NRST  (via drill 0.6)
  Top 0.203: SW1.P$1 80.9,5.94 76.6,5.94 SW1.P$2 75.8,6.34 73.2,6.34 73.2,7.94 R61.1 73.2,8.84 73.6,9.24 v73.6,11.24 | v72.51,18.98 71.8,18.61 U1.7
  Bottom 0.203: v72.51,18.98 72.82,14.04 73.4,11.44 v73.6,11.24
PA2|WDT  (via drill 0.6)
  Top 0.203: U1.16 72.79,23.11 73.8,24.54 76.85,26.02 v78.13,29.17
  Bottom 0.203: U$3.56 103.7,21.92 v78.13,29.17
PA9_USART1_TX  (via drill 0.6)  (1 unrouted)
  Top 0.203: U1.42 58.97,18.61 58,18.64 v58,19.04
  Bottom 0.203: v58,19.04 57.9,19.14 54.6,19.14 53.8,19.94 52.9,19.94
PA10_USART1_RX  (via drill 0.6)  (1 unrouted)
  Top 0.203: U1.43 58.91,18.11 57.1,18.14 v57.1,20.04 | v54.9,20.04 53.4,18.54 52.8,18.54 52.8,17.84
  Bottom 0.203: v54.9,20.04 v57.1,20.04
PA11_CANRXD
  Top 0.203: U1.44 59,17.61 56.2,17.64 56.21,21.24
PA12-CANTXD  (via drill 0.6)
  Top 0.203: U1.45 58.94,17.11 v54.9,17.14
  Bottom 0.203: v54.9,17.14 53.5,18.54
PB8|LED  (via drill 0.6)
  Top 0.203: v67.6,11.64 67.6,13.14 U1.61 | v65.1,10.14 64.6,9.64 64.6,9.34 LED2.C
  Bottom 0.203: v67.6,11.64 66.1,10.14 v65.1,10.14
PB11|VCAP  (via drill 0.6)
  Top 0.203: v62.3,26.44 62.5,26.44 62.6,26.34 62.62,25.68 U1.30
  Bottom 0.203: v62.3,26.44 61.5,26.44 C7.1 60.6,26.84 59.3,26.84 C8.1
PD0_OSC_IN_XTAL
  Top 0.203: U1.5 71.93,17.61 72.76,17.6 73.95,17.1 74.89,17.04 R52.1 C1.1 75.26,15.24 77.88,15.24 Q1.2
PD1_OSC_OUT
  Top 0.203: Q1.1 77.88,20.34 75.26,20.34 C2.1 74.86,19.84 R52.2 74.9,18.76 74.06,18.73 72.69,18.12 72.57,18.11 U1.6
S1
  Bottom 0.203: U$3.37 111.21,15.38 111.2,12.47 105.61,9.33 97.93,8.01 97.2,4.08 97.06,1.63 U$5.18
S2
  Bottom 0.203: U$3.35 112.2,15.05 112.26,11.92 106.25,8.25 103.11,7.63 102.18,1.63 U$5.16
S3
  Bottom 0.203: U$3.33 113.23,14.72 113.32,11.31 110.4,9.21 107.9,7.21 107.79,4.65 107.26,1.74 U$5.14
S4
  Bottom 0.203: U$3.31 116.04,18.95 116.7,15.39 115,10.68 113.05,8.25 112.35,1.71 U$5.12
S5
  Bottom 0.203: U$3.29 117.04,19.96 118.97,14.89 118.65,10.17 118.17,8.39 118.16,4.88 117.43,1.82 U$5.10
S6
  Bottom 0.203: U$3.27 118,20.96 122.91,11.47 123.15,5.74 122.54,4 122.49,1.71 U$5.8
S7
  Bottom 0.203: U$3.25 119.02,21.96 127.53,10.19 128.26,5.22 127.67,1.79 U$5.6
S8
  Bottom 0.203: U$3.23 119.86,22.96 133.02,9.03 133.36,5.67 132.73,1.76 U$5.4
S9
  Bottom 0.203: U$3.21 120.43,23.96 138.09,8.55 138.63,7.08 138.6,5.13 137.79,1.71 U$5.2
S10
  Bottom 0.203: U$3.19 116.65,24.98 140.33,35.08 140.32,40.24 U$6.1
S11
  Bottom 0.203: U$3.17 116.04,25.98 134.03,33.98 134.5,35.2 135.24,40.24 U$6.3
S12
  Bottom 0.203: U$3.15 112.71,29.02 124.01,33.14 128.53,33.82 129.37,34.77 130.17,40.21 U$6.5
S13
  Bottom 0.203: U$3.13 111.66,29.5 121.5,34.43 124.1,34.73 124.31,35.2 125.04,40.27 U$6.7
S14
  Bottom 0.203: U$3.11 110.69,29.96 116.47,34.01 118.94,34.96 119.28,38.03 119.97,40.31 U$6.9
S15
  Bottom 0.203: U$3.9 109.71,30.41 114.04,35 114.07,37.62 114.91,40.26 U$6.11
S16
  Bottom 0.203: U$3.7 108.74,30.88 109.13,35.17 109.11,38.22 U$6.13
S17
  Bottom 0.203: U$3.5 107.71,29.37 104.04,34.9 104.01,37.42 U$6.15
S18
  Bottom 0.203: U$3.3 106.7,29.09 100.2,33.5 99.3,34.97 99.25,37.4 99.6,40.26 U$6.17
SP1_MISO-SDO  (via drill 0.6)
  Top 0.203: U1.22 66.62,25.64 66.61,27.3 67.02,31.06 67.87,31.01 R46.1 67.99,30.96 67.98,31.96 71.29,31.94 v74.23,32.39
  Bottom 0.203: U$3.54 76.27,28.11 v74.23,32.39
SP1_NSS-CSB  (via drill 0.6)
  Top 0.203: U1.20 67.61,26.35 76.36,29.66 77.82,31.65 v77.84,31.62
  Bottom 0.203: v77.84,31.62 77.78,31.6 U$3.61
SPI1_MOSI-SDI  (via drill 0.6)
  Top 0.203: v66.04,30.68 66.22,30.05 66.1,26.44 66.12,25.64 U1.23 | v71.87,30.67 v74.16,30.57
  Bottom 0.203: U$3.53 75.8,27.62 v74.16,30.57 | v71.87,30.67 70.91,30.43 67.11,30.47 66.49,30.55 v66.04,30.68
SPI1_SCK-CLK  (via drill 0.6)
  Top 0.203: U1.21 67.11,26.67 73.76,29.16 75.53,30.12 v76.19,32.44
  Bottom 0.203: U$3.62 79.42,32.15 78.23,32.82 77.3,32.78 77.25,32.77 v76.19,32.44
VCC  (via drill 0.6)  (20 unrouted)
  Top 0.203: R59.1 69.5,10.44 69.5,11.14 69.5,11.2 | R61.2 72.7,10.54 72.7,11.14 72.76,11.21 | v59.11,11.82 58.6,11.64 | 72.7,29.51 72.7,29.54 | R46.2 70.68,31.04 70.74,29.28
  Bottom 0.203: C3.1 67,22.84 67.2,22.84 67.2,21.64 C5.1 68.2,20.74 | 68.2,18.54 C21.1 69.1,17.54 | v65.9,15.04 v63.2,12.34 63.2,9.94 64.1,9.04 64.1,7.14 R60.2 | 53.5,8.04 57.1,11.64 v59.11,11.82
  Bottom 0.406: v68.2,19.64 68.2,20.74 | 68.2,18.54 v68.2,19.64 | C4.1 67.53,18.99 68.15,19.58 v68.2,19.64
  other vias: 64.71,28.03 68.31,28.66 71.95,26.98
VREF1
  Bottom 0.203: U$3.51 79.35,26.56 79.31,25.7 C35.1
VREF2  (via drill 0.6)
  Top 0.305: v84.3,18.84 C34.1
  Bottom 0.203: R51.2 84.28,14.25 83.59,14.25 83.57,17.76 R50.2 84.26,18.5 v84.3,18.84 | U$3.50 81.02,26.17 81.03,25.11 83.47,20.84 83.44,18.8 83.47,18.84
  Bottom 0.305: v84.3,18.84 83.47,18.84
VREG  (via drill 0.6)  (2 unrouted)
  Top 0.203: v55.1,37.24 55.1,36.44
  Top 0.305: 55.27,31.16 C36.1
  Bottom 0.203: 55.5,37.34 54.95,37.84 55.3,37.44 v55.1,37.24 | U$3.48 105.71,16.56 105.71,17.35 105.32,17.35 104.83,17.88 104.81,19.92 U$3.52 78.44,27.09
  Bottom 0.406: 54.95,37.84 54.95,38.65 | 78.44,27.09 75.3,27.08 73.06,30.05 72.36,32.75 70.51,33.78 68.49,33.99 58.92,35.35 v55.09,37.23 v55.1,37.24
VSS_1  (via drill 0.6)
  Top 0.203: v62.1,23.74 62.1,24.54 U1.31
  Bottom 0.203: v62.1,23.74 62.1,22.74 C11.1
VSS_2  (via drill 0.6)
  Top 0.203: v61,16.14 60.2,16.14 U1.47
  Bottom 0.203: v61,16.14 61.9,16.14 C13.1

### Text on the board
bNames: 5
tValues: 3.3V | DIGITAL | +5V | 3.2v | ANALOG | 3.2